# EAGLE schematic untitled (EAGLE 6.1)
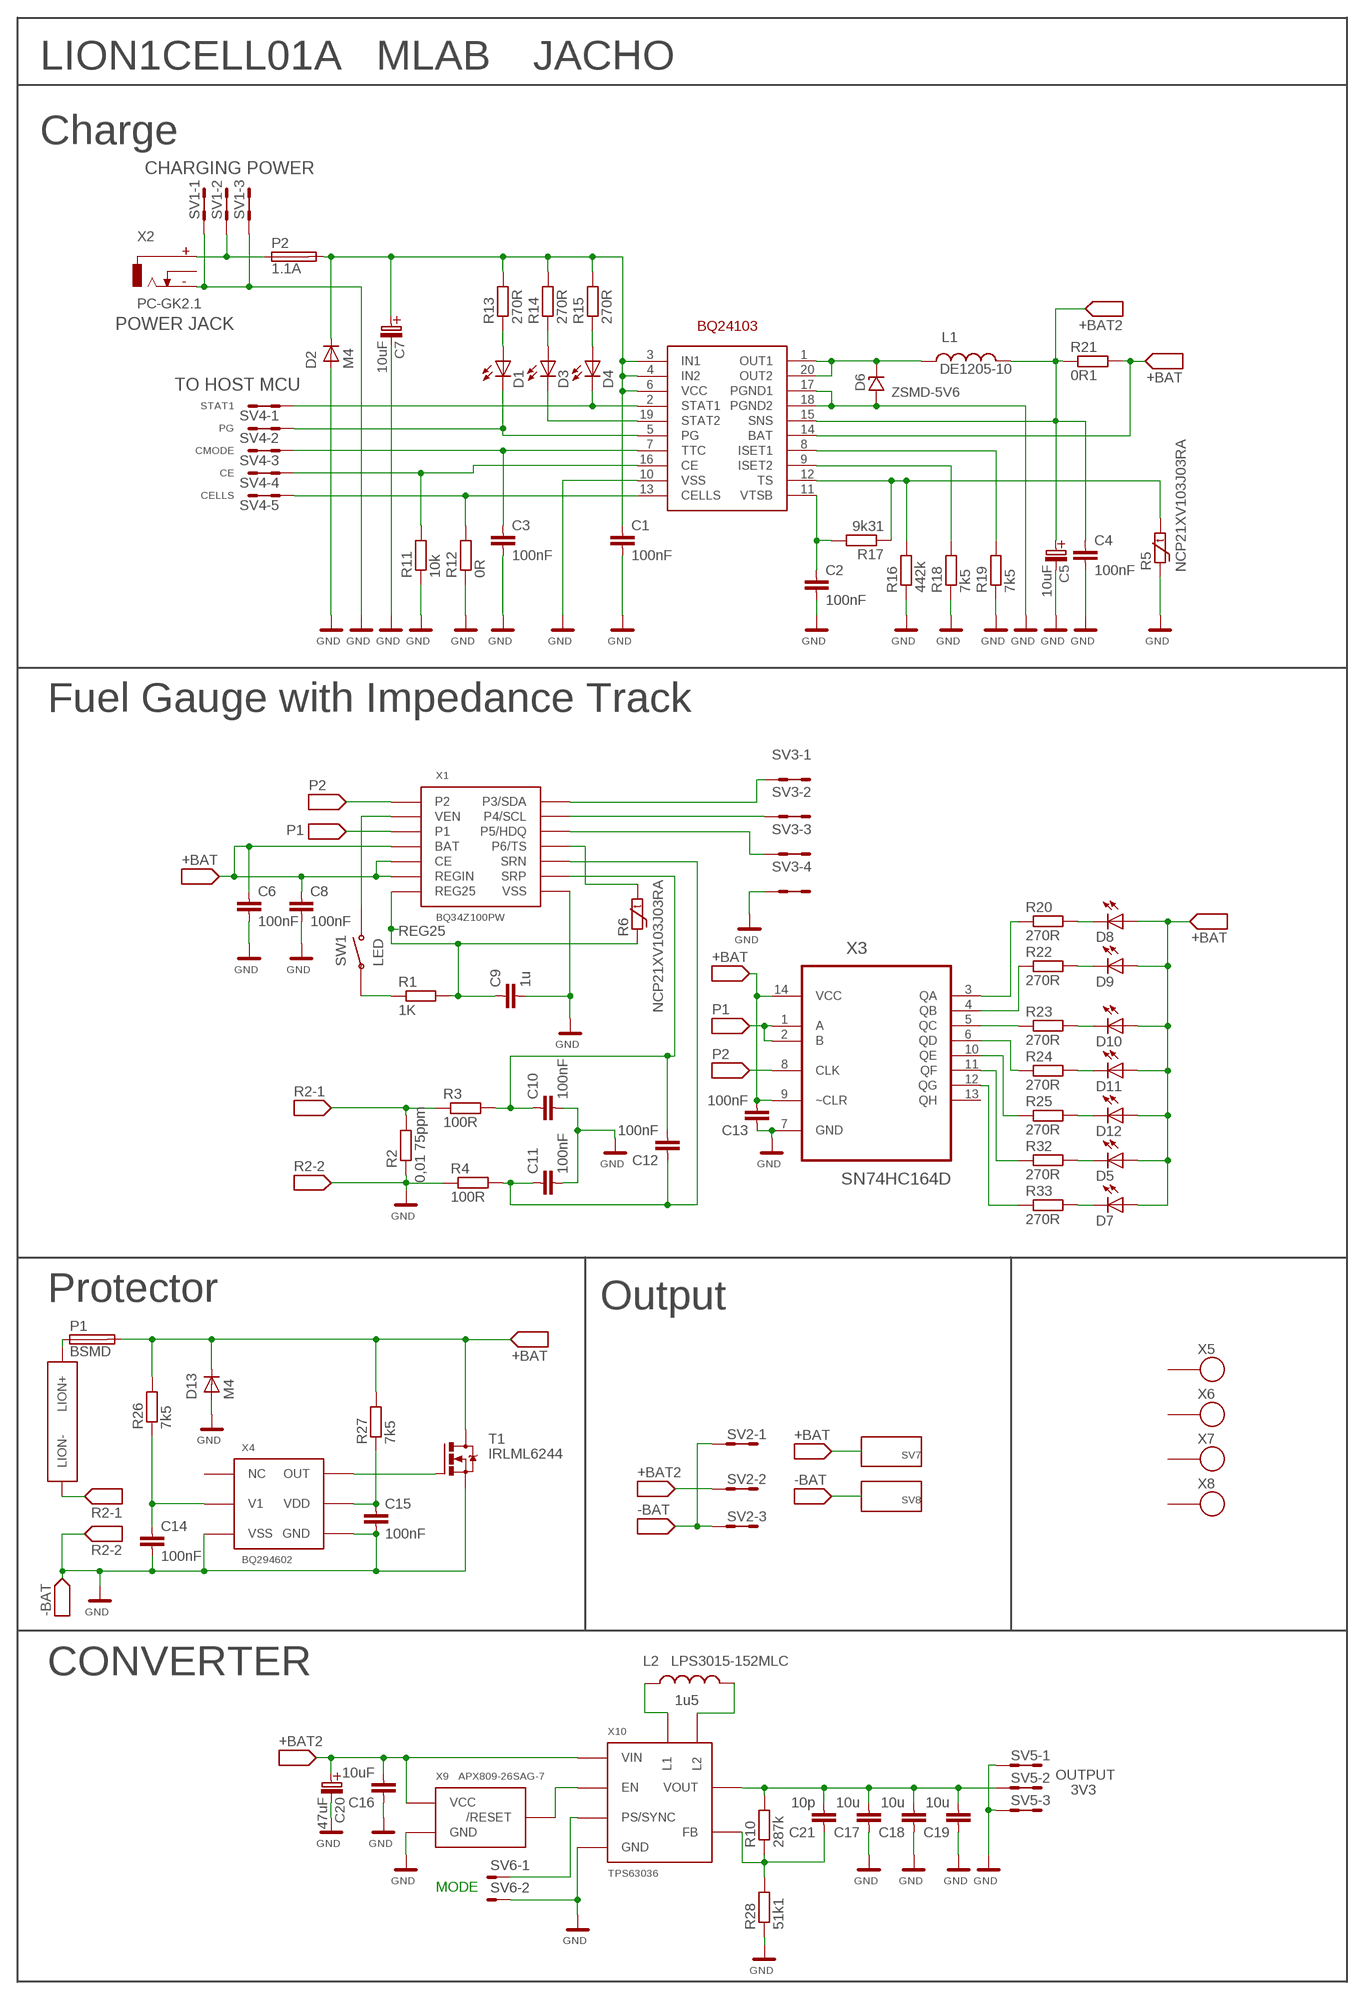
[diagram p0: schematic, sheet 1]

## Parts
C1  100nF  C0805  [C0805]
C2  100nF  C0805  [C0805]
C3  100nF  C0805  [C0805]
C4  100nF  C0805  [C0805]
C5  10uF  B  [B]
C6  100nF  C0805  [C0805]
C7  10uF  B  [B]
C8  100nF  C0805  [C0805]
C9  1u  C0805  [C0805]
C10  100nF  C0805  [C0805]
C11  100nF  C0805  [C0805]
C12  100nF  C0805  [C0805]
C13  100nF  C0805  [C0805]
C14  100nF  C0805  [C0805]
C15  100nF  C0805  [C0805]
C16  10uF  C0805  [C0805]
C17  10u  C0805  [C0805]
C18  10u  C0805  [C0805]
C19  10u  C0805  [C0805]
C20  47uF  B  [B]
C21  10p  C0603  [0603]
D1  LED1206_2  [1206_2]
D2  M4  D-OB.  [SMB]
D3  LED1206_2  [1206_2]
D4  LED1206_2  [1206_2]
D5  LED1206_2  [1206_2]
D6  ZSMD-5V6  D-ZENEROVA  [MINIMELF]
D7  LED1206_2  [1206_2]
D8  LED1206_2  [1206_2]
D9  LED1206_2  [1206_2]
D10  LED1206_2  [1206_2]
D11  LED1206_2  [1206_2]
D12  LED1206_2  [1206_2]
D13  M4  D-OB.SMA  [SMA]
L1  DE1205-10  [DE1205-10]
L2  LPS3015-152MLC  LPS3015  [LPS3015]
P1  BSMD  POJISTKA2410  [2410]
P2  1.1A  POJISTKA_1812  [1812]
R1  1K  R0805  [0805]
R2  0,01 75ppm  R0805  [0805]
R3  100R  R0805  [0805]
R4  100R  R0805  [0805]
R5  NCP21XV103J03RA  TERMISTOR0805  [0805]
R6  NCP21XV103J03RA  TERMISTOR0805  [0805]
R10  287k  R0603  [0603]
R11  10k  R0805  [0805]
R12  0R  R0805  [0805]
R13  270R  R0805  [0805]
R14  270R  R0805  [0805]
R15  270R  R0805  [0805]
R16  442k  R0805  [0805]
R17  9k31  R0805  [0805]
R18  7k5  R0805  [0805]
R19  7k5  R0805  [0805]
R20  270R  R0805  [0805]
R21  0R1  R-EU_R2512  [R2512]
R22  270R  R0805  [0805]
R23  270R  R0805  [0805]
R24  270R  R0805  [0805]
R25  270R  R0805  [0805]
R26  7k5  R0805  [0805]
R27  7k5  R0805  [0805]
R28  51k1  R0603  [0603]
R32  270R  R0805  [0805]
R33  270R  R0805  [0805]
SV1  MA03-2  [MA03-2]
SV2  MA03-2  [MA03-2]
SV3  MA04-2  [MA04-2]
SV4  MA05-2  [MA05-2]
SV5  MA03-2  [MA03-2]
SV6  MA02-1  [MA02-1]
SV7  WAGO256  [WAGO256]
SV8  WAGO256  [WAGO256]
SW1  TACT-64K  [TACT-64K]
T1  IRLML6244  IRLML6244TRPBF  [SOT23]
U1  BQ24103  [RHL_R-VQFN-N20]
U$2  LION1  [LION1]
X1  BQ34Z100PW  [TSSOP14]
X2  DC2.1MM  [DC2.1MM]
X3  SN74HC164D  [SOIC127P600X175-14N]
X4  BQ294602  [SON_N6]
X5  SROUB3M  [SROUB3M]
X6  SROUB3M  [SROUB3M]
X7  SROUB3M  [SROUB3M]
X8  SROUB3M  [SROUB3M]
X9  APX809-26SAG-7  APX809-26SA  [SOT23]
X10  TPS63036  [DSBGA8]

## Nets
+BAT: C6.1 C8.1 C13.2 D5.A D7.A D8.A D9.A D10.A D11.A D12.A D13.K(C) P1.2 R21.2 R26.2 R27.2 SV7.1 SV7.A1 T1.3(D) U1.14(BAT) X1.4(BAT) X1.5(CE) X1.6(REGIN) X3.9(~CLR) X3.14(VCC)
+BAT2: C4.1 C5.+(C_EL+) C16.2 C20.+(C_EL+) L1.P$2 R21.1 SV2.3 SV2.4 U1.15(SNS) X9.3(VCC) X10.A1(VIN)
EN: X9.2(/RESET) X10.A2(EN)
GND: C1.2 C2.2 C3.2 C4.2 C5.-(C_EL-) C6.2 C7.-(C_EL-) C8.2 C9.2 C10.2 C11.2 C13.1 C14.2 C15.2 C16.1 C17.1 C18.1 C19.1 C20.-(C_EL-) D2.A D6.A D13.A R2.1 R4.1 R5.1 R11.1 R12.1 R16.1 R18.1 R19.1 R28.1 SV1.1 SV1.2 SV1.5 SV1.6 SV2.1 SV2.2 SV2.5 SV2.6 SV3.7 SV3.8 SV5.1 SV5.2 SV5.5 SV5.6 SV6.2 SV8.1 SV8.A1 T1.2(S) U1.10(VSS) U1.17(PGND1) U1.18(PGND2) X1.8(VSS) X2.GND(-) X3.7(GND) X4.3(VSS) X4.4(VSS) X4.7(GND) X9.1(GND) X10.C2(GND)
N$1: C1.1 C7.+(C_EL+) D2.K(C) P2.2 R13.2 R14.2 R15.2 U1.3(IN1) U1.4(IN2) U1.6(VCC)
N$2: P1.1 U$2.+1(LION+) U$2.+(LION+)
N$3: D6.C(K) L1.P$1 U1.1(OUT1) U1.20(OUT2)
N$4: D4.K(C) SV4.1 SV4.2 U1.2(STAT1)
N$5: D3.K(C) U1.19(STAT2)
N$6: D1.K(C) SV4.3 SV4.4 U1.5(PG)
N$7: D1.A R13.1
N$8: D3.A R14.1
N$9: D4.A R15.1
N$10: R12.2 SV4.9 SV4.10 U1.13(CELLS)
N$11: R11.2 SV4.7 SV4.8 U1.16(CE)
N$12: C2.1 R17.2 U1.11(VTSB)
N$13: R18.2 U1.9(ISET2)
N$14: C3.1 SV4.5 SV4.6 U1.7(TTC)
N$15: R19.2 U1.8(ISET1)
N$16: SV3.3 SV3.4 X1.13(P4/SCL)
N$17: SW1.P$3 SW1.P$4 X1.2(VEN)
N$18: R5.2 R16.2 R17.1 U1.12(TS)
N$19: L2.1-1 L2.1-2 L2.1-3 X10.B1(L1)
N$20: R1.1 SW1.P$1 SW1.P$2
N$21: SV6.1 X10.B2(PS/SYNC)
N$22: R6.2 X1.11(P6/TS)
N$23: C10.1 C12.2 R3.2 X1.9(SRP)
N$24: SV3.5 SV3.6 X1.12(P5/HDQ)
N$25: SV3.1 SV3.2 X1.14(P3/SDA)
N$26: L2.2-1 L2.2-2 L2.2-3 X10.C1(L2)
N$27: C11.1 C12.1 R4.2 X1.10(SRN)
N$31: C17.2 C18.2 C19.2 C21.2 R10.2 SV5.3 SV5.4 X10.D1(VOUT)
N$32: C21.1 R10.1 R28.2 X10.D2(FB)
N$33: R20.1 X3.3(QA)
N$34: D8.K(C) R20.2
N$35: R22.1 X3.4(QB)
N$36: R23.1 X3.5(QC)
N$37: R24.1 X3.6(QD)
N$38: R25.1 X3.10(QE)
N$39: D9.K(C) R22.2
N$40: D11.K(C) R24.2
N$41: D12.K(C) R25.2
N$42: D10.K(C) R23.2
N$43: C14.1 R26.1 X4.2(V1)
N$44: C15.1 R27.1 X4.5(VDD)
N$45: T1.1(G) X4.6(OUT)
N$46: R32.1 X3.11(QF)
N$47: R33.1 X3.12(QG)
N$49: D5.K(C) R32.2
N$50: D7.K(C) R33.2
N$69: P2.1 SV1.3 SV1.4 X2.+
P1: X1.3(P1) X3.1(A) X3.2(B)
P2: X1.1(P2) X3.8(CLK)
R2: R2.2 R3.1 U$2.-1(LION-) U$2.-(LION-)
REG25: C9.1 R1.2 R6.1 X1.7(REG25)
Unconnected: X2.SW X3.13(QH) X4.1(NC) X5.P$1 X6.P$1 X7.P$1 X8.P$1

## Notes on the sheet
- LION1CELL01A | MLAB | JACHO
- Charge
- CHARGING POWER
- POWER JACK
- TO HOST MCU
- STAT1
- PG
- CMODE
- CE
- CELLS
- Fuel Gauge with Impedance Track
- REG25
- LED
- Protector | Output
- CONVERTER
- 1u5
- OUTPUT
- 3V3
- MODE

## Library data of the parts
C1-C4 C6 C8-C19 = moje_C:C0805
C5 C7 C20 = moje_C:B
C21 = moje_C:C0603
D1 D3-D5 D7-D12 = moje_diody:LED1206_2
D2 = moje:D-OB.: smb
D6 = moje_diody:D-ZENEROVA
D13 = moje:D-OB.SMA: SMA
L1 = moje_L:DE1205-10: tlumivka
L2 = moje_L:LPS3015
P1 = moje:POJISTKA2410: Pojistka BSMD (tme) v pouzdru 2410
P2 = moje:POJISTKA_1812: Pojistka s pouzdrem 1812
R1-R4 R11-R20 R22-R27 R32 R33 = moje_R:R0805
R5 R6 = moje_R:TERMISTOR0805
R10 R28 = moje_R:R0603
R21 = rcl:R-EU_: RESISTOR, European symbol
SV1 SV2 SV5 = moje_hrebinky:MA03-2: PIN HEADER; OC_FARNELL: unknown; OC_NEWARK: unknown
SV3 = moje_hrebinky:MA04-2: PIN HEADER; OC_FARNELL: unknown; OC_NEWARK: unknown
SV4 = moje_hrebinky:MA05-2: PIN HEADER; OC_FARNELL: unknown; OC_NEWARK: unknown
SV6 = moje_hrebinky:MA02-1
SV7 SV8 = moje_konektory:WAGO256: WAGO256
SW1 = moje_tlacitka:TACT-64K: Resetovací tlačítko TACT-64K
T1 = moje_T:IRLML6244TRPBF: HEXFET Power MOSFET
U1 = bq24103:BQ24103
U$2 = moje_baterky:LION1
X1 = moje_io:BQ34Z100PW
X2 = moje_konektory:DC2.1MM
X3 = moje_io:SN74HC164D: 8-BIT PARALLEL-OUT SERIAL SHIFT REGISTERS; MPN: SN74HC164D; OC_FARNELL: 9591184; OC_NEWARK: 36K3553; PACKAGE: SOIC-14; SUPPLIER: Texas Instruments
X4 = moje_io:BQ294602
X5-X8 = moje:SROUB3M
X9 = moje_io:APX809-26SA
X10 = moje_io:TPS63036